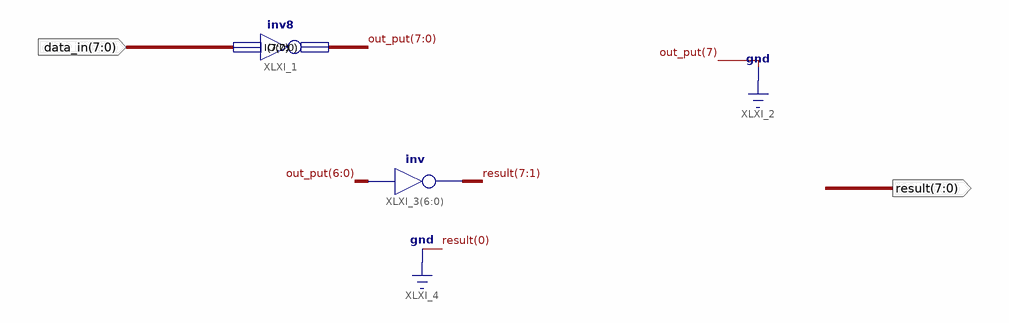
[diagram p0: schematic sheet 1]
// Xilinx ISE schematic shifter_8bit.sch (spartan6) as structural Verilog: 2 symbols, 2 ports
module shifter_8bit (
  input  [7:0] data_in,
  output [7:0] result
);

  wire [7:0] out_put;

  inv8 XLXI_1 (.I(data_in), .O(out_put));
  assign result[7:1] = ~out_put[6:0];  // inv XLXI_3[6..0], 7 bits wide

  assign result[0] = 1'b0;
  // also tied to GND on the sheet: out_put[7]
endmodule
